# Altium schematic sheet Debug.SchDoc
size A4; Date: Date; CompanyName: HESSO; Engineer: Name; Address1: Route du Rawyl 47; Address2: 1950 Sion; Address3: Switzerland; DocumentNumber: 1; SheetNumber: 2; SheetTotal: 4; ProjectName: Project Name
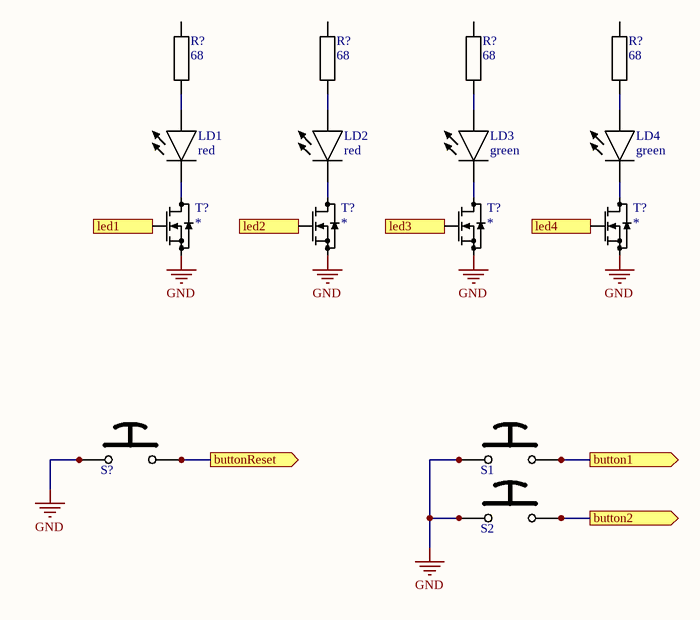
[diagram p0: Debug.SchDoc]

## Parts
(Parts that share a designator on the sheet are numbered #1, #2 ... from top to bottom, then left to right.)
LD1  red  [LED 1608 REFLOW]
LD2  red  [LED 1608 REFLOW]
LD3  green  [LED 1608 REFLOW]
LD4  green  [LED 1608 REFLOW]
R?#1  68  [RESISTOR 1608 REFLOW]
R?#2  68  [RESISTOR 1608 REFLOW]
R?#3  68  [RESISTOR 1608 REFLOW]
R?#4  68  [RESISTOR 1608 REFLOW]
S1  *  [Push Button C6.0x6.0 TE FSM-2J-SMA]  (value not drawn)
S2  *  [Push Button C6.0x6.0 TE FSM-2J-SMA]  (value not drawn)
S?  *  [Push Button C6.0x6.0 TE FSM-2J-SMA]  (value not drawn)
T?#1  *  [SOT23 P0.95 C1.6x3.0 H1.3]
T?#2  *  [SOT23 P0.95 C1.6x3.0 H1.3]
T?#3  *  [SOT23 P0.95 C1.6x3.0 H1.3]
T?#4  *  [SOT23 P0.95 C1.6x3.0 H1.3]

## Ports
button1 (out), button2 (out), buttonReset (out), led1 (in), led2 (in), led3 (in), led4 (in)

## Nets
GND: S1.1 S1.2 S2.1 S2.2 S?.1 S?.2 T?#1.2(S) T?#2.2(S) T?#3.2(S) T?#4.2(S)
button1: S1.3 S1.4 ; port button1
button2: S2.3 S2.4 ; port button2
buttonReset: S?.3 S?.4 ; port buttonReset
led1: T?#1.1(G) ; port led1
led2: T?#2.1(G) ; port led2
led3: T?#3.1(G) ; port led3
led4: T?#4.1(G) ; port led4
NetLD1_1: LD1.1(C) T?#1.3(D)
NetLD1_2: LD1.2(A) R?#1.1
NetLD2_1: LD2.1(C) T?#2.3(D)
NetLD2_2: LD2.2(A) R?#2.1
NetLD3_1: LD3.1(C) T?#3.3(D)
NetLD3_2: LD3.2(A) R?#3.1
NetLD4_1: LD4.1(C) T?#4.3(D)
NetLD4_2: LD4.2(A) R?#4.1

Not connected (* = marked no-connect by the designer): R?#1 2; R?#2 2; R?#3 2; R?#4 2

## Notes on the sheet
- Date :
- Revision :
- Sheet
- of
- Design by :

## Library data of the parts
LD1-LD4 = LED: LED generic; Value: *
R?#1-R?#4 = Resistor: Value: *
S1 S2 S? = Push Button 4Pins: Push Button, 4 pins, 2 poles parrallèle; Value: *
T?#1-T?#4 = MOS-N SOT23 G-S-D: Generic MOS-N; Value: *